# EAGLE design ism-boardlet (EAGLE 6.5.0)
CNAME: An RFM69CW breakout board; CREVISION: 1; DESIGNER: Johan Kanflo
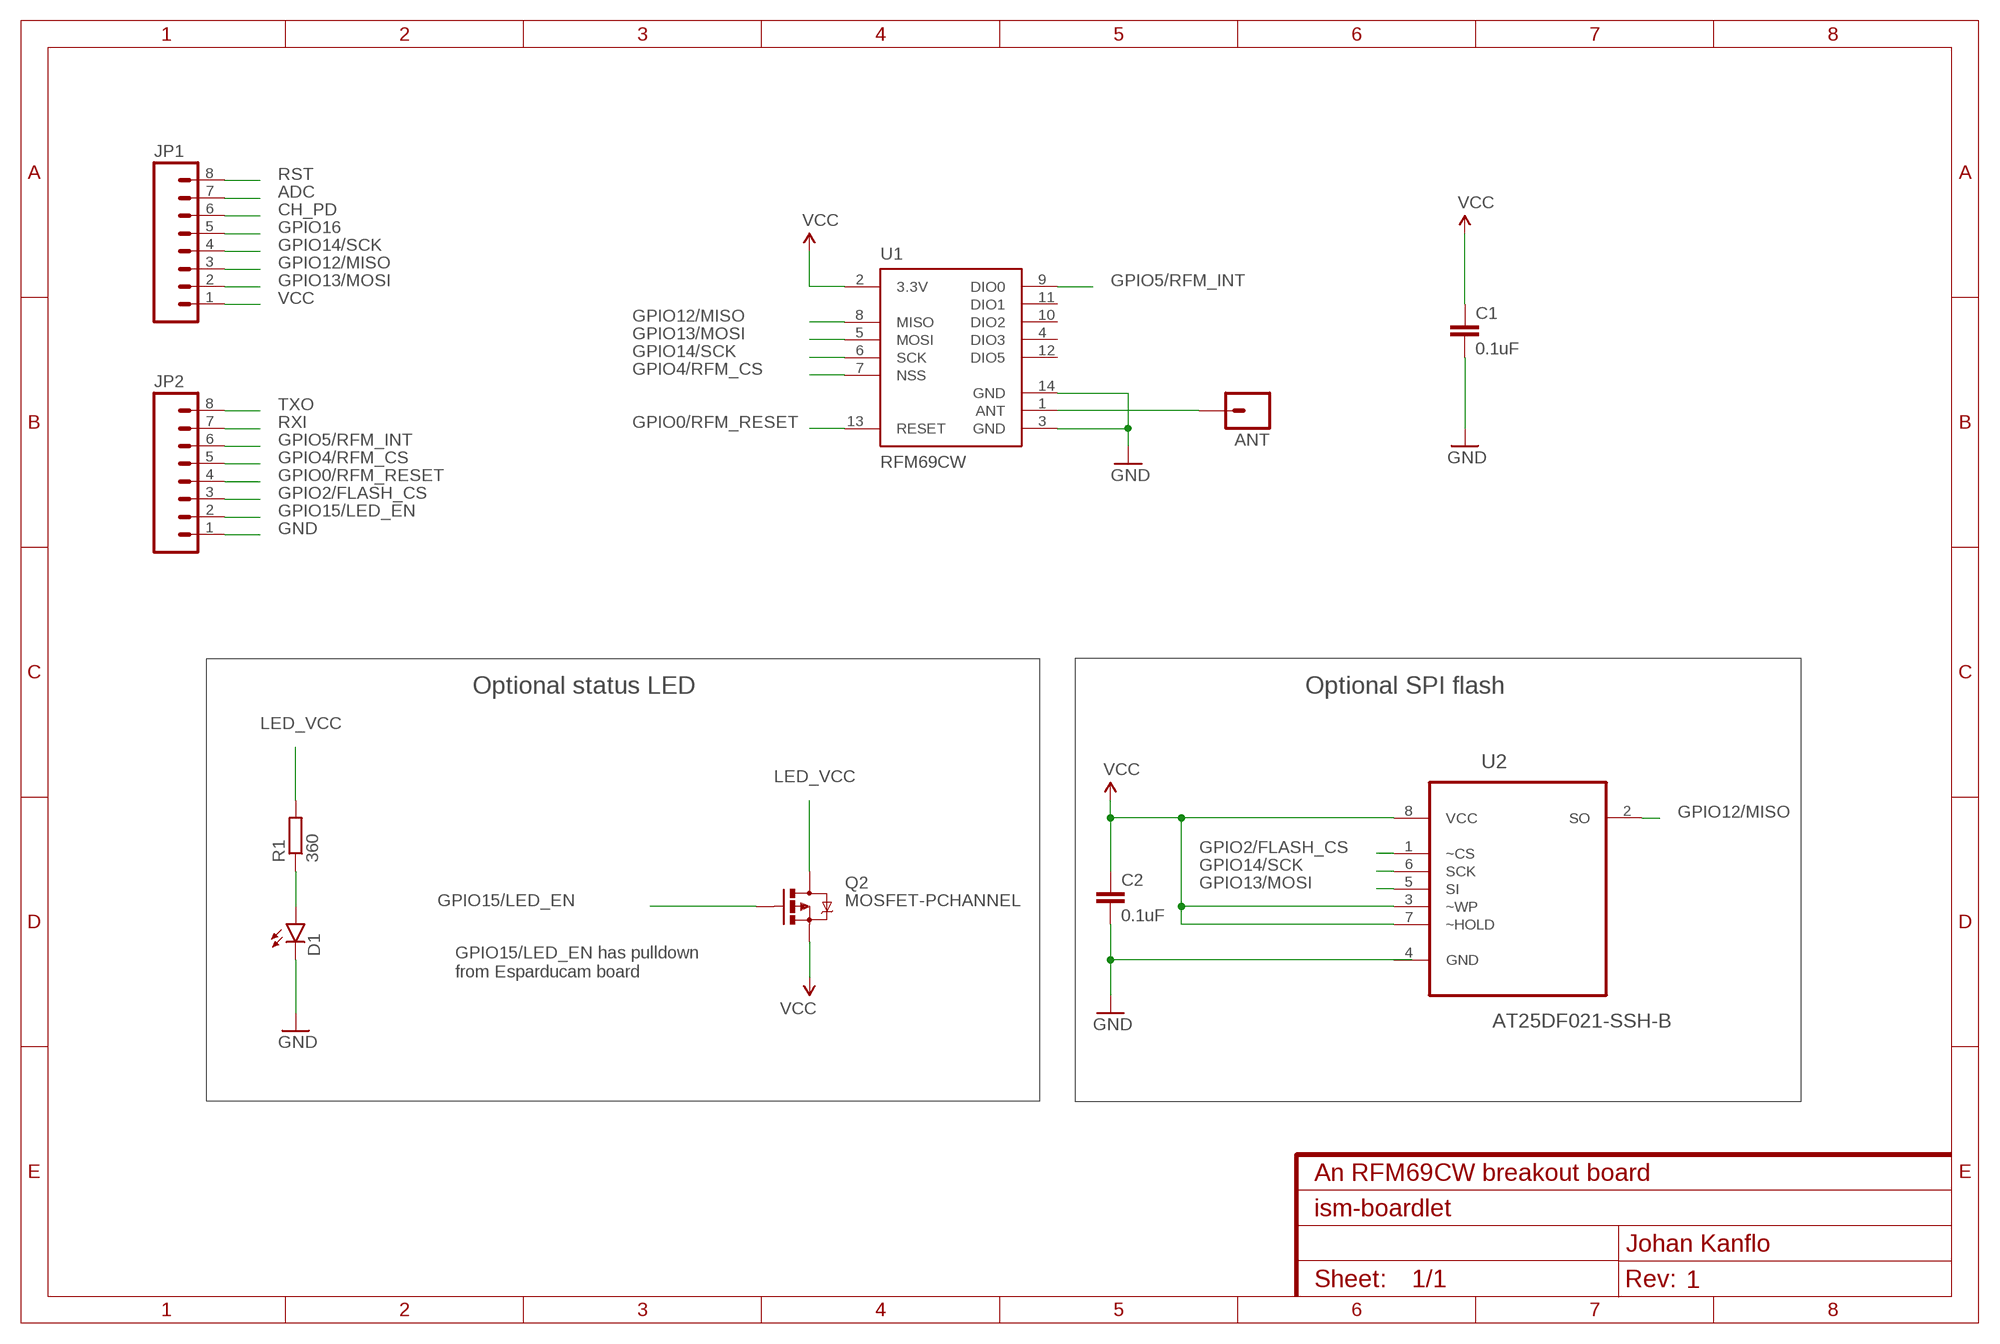
[diagram p0: schematic, sheet 1]

## Parts
ANT  M01PTH  [1X01]
C1  0.1uF  CAP0603-CAP  [0603-CAP]
C2  0.1uF  CAP0603-CAP  [0603-CAP]
D1  LED0603  [LED-0603]
JP1  M08  [1X08_ROUND]
JP2  M08  [1X08_ROUND]
Q2  MOSFET-PCHANNEL  [SOT23-3]
R1  360  R-EU_R0603  [R0603]
U1  RFM69CW  [RFM69CW-XXXS2]
U2  AT25DF021-SSH-B  [SOIC127P600X175-8N]

## Nets
ADC: JP1.7
CH_PD: JP1.6
GND: C1.2 C2.2 D1.C JP2.1 U1.3(GND) U1.14(GND)
GPIO0/RFM_RESET: JP2.4 U1.13(RESET)
GPIO2/FLASH_CS: JP2.3 U2.1(~CS)
GPIO4/RFM_CS: JP2.5 U1.7(NSS)
GPIO5/RFM_INT: JP2.6 U1.9(DIO0)
GPIO12/MISO: JP1.3 U1.8(MISO) U2.2(SO)
GPIO13/MOSI: JP1.2 U1.5(MOSI) U2.5(SI)
GPIO14/SCK: JP1.4 U1.6(SCK) U2.6(SCK)
GPIO15/LED_EN: JP2.2 Q2.1(G)
GPIO16: JP1.5
LED_VCC: Q2.3(D) R1.2
N$1: D1.A R1.1
N$8: ANT.1 U1.1(ANT)
RST: JP1.8
RXI: JP2.7
TXO: JP2.8
VCC: C1.1 C2.1 JP1.1 Q2.2(S) U1.2(3.3V) U2.3(~WP) U2.7(~HOLD) U2.8(VCC)
Unconnected: U1.4(DIO3) U1.10(DIO2) U1.11(DIO1) U1.12(DIO5) U2.4(GND)

## Notes on the sheet
- Optional status LED | Optional SPI flash
- GPIO15/LED_EN has pulldown
  from Esparducam board

## Library data of the parts
ANT = SparkFun-Connectors:M01: Header 1 Standard 1-pin 0.1" header. Use with straight break away headers (SKU : PRT-00116), right angle break away headers (PRT-00553), swiss pins (PRT-00743), machine pins (PRT-00117), and female headers (PRT-00115).
C1 C2 = SparkFun-Capacitors:CAP: Capacitor Standard 0603 ceramic capacitor, and 0.1" leaded capacitor.
D1 = SparkFun-LED:LED: LEDs Standard schematic elements and footprints for 5mm, 3mm, 1206, and 0603 sized LEDs. 5mm - Spark Fun Electronics SKU : COM-00529 (and others)
JP1 JP2 = SparkFun-Connectors:M08: Header 8 Standard 8-pin 0.1" header. Use with straight break away headers (SKU : PRT-00116), right angle break away headers (PRT-00553), swiss pins (PRT-00743), machine pins (PRT-00117), and female headers (PRT-00115).
Q2 = SparkFun-DiscreteSemi:MOSFET-PCHANNEL: Generic PMOSFET IRLML2244 - TRANS-11153 (SOT-23 -20V -4.3A) (1.Gate 2.Source 3.Drain) FQP27P06 - COM-10349 <http://www.sparkfun.com/products/10349> (TO-220 -60V -27A) (1.Gate 2.Source 3.Drain); PROD_ID: TRANS-08285
R1 = resistor:R-EU_: RESISTOR, European symbol
U1 = SparkFun-RF:RFM69
U2 = Atmel_By_element14_Batch_1-00:AT25DF021-SSH-B: 2-Megabit Minimum SPI Serial Flash Memory; MPN: AT25DF021-SSH-B; OC_FARNELL: 1715438; OC_NEWARK: 15R0303; PACKAGE: SOIC-8; SUPPLIER: Atmel

## Board
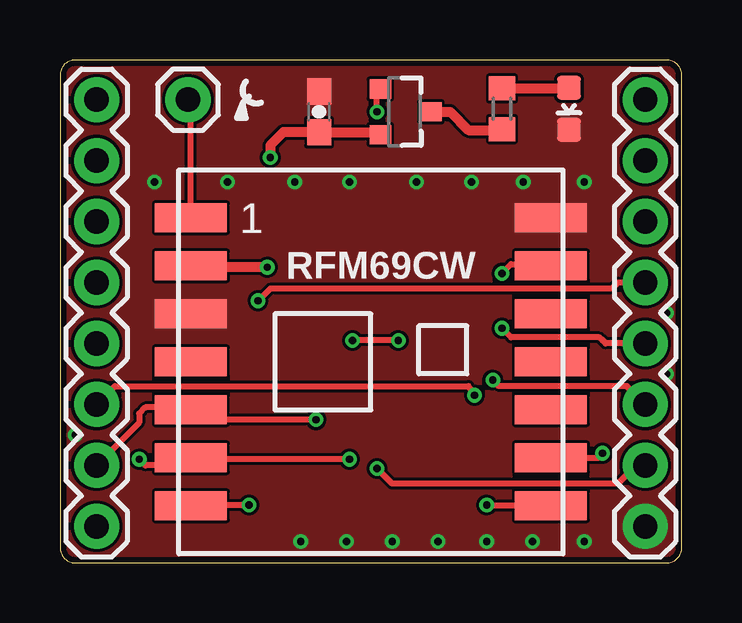
[diagram p1: board, top side]
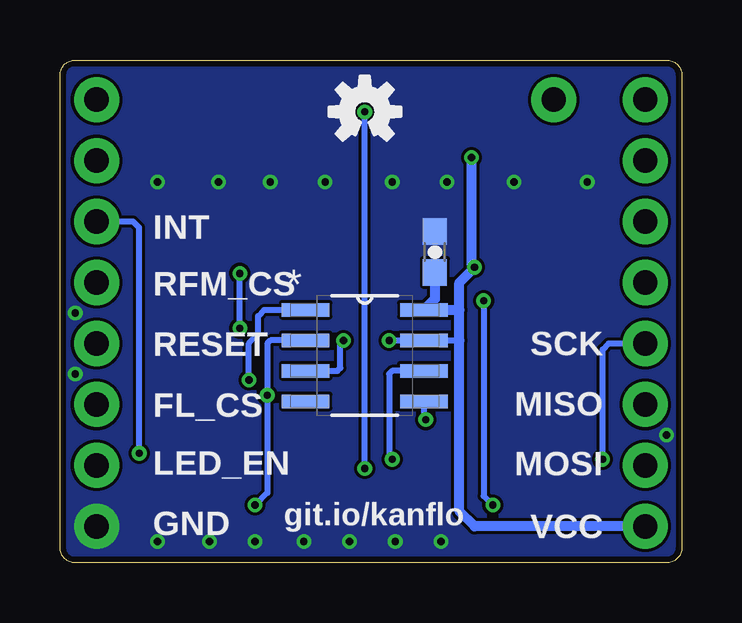
[diagram p2: board, bottom side, seen from below]

Size 25.91 x 20.95 mm. Coordinates in mm from the lower left corner, seen from the top.
Outline: 0,20.32 0,0.63 arc90 0.63,0 25.27,0 arc90 25.91,0.63 25.91,20.32 arc90 25.27,20.95 0.63,20.95 arc90 0,20.32
Copper layers (1*16): Top 0.035mm / dielectric 1.5mm / Bottom 0.035mm
Design rules "dirt_cheap_dirty_boards.v1": minimum track width 5mil, minimum drill 12mil, track to track 5mil, track to pad 5mil, pad to pad 5mil, via to via 5mil, smd to smd 0mil, copper to edge 10mil, drill to drill 10mil, minimum pad ring 10mil, minimum via ring 6mil, stop-mask expansion 2mil, vias tented up to drill 25mil, thermal gap 10mil

### Footprints (pad centres in the part's own frame; a part is rotated, then mirrored left to right if it is on the bottom)
1X01 = drill 1.016 pad 1.88: 1 0,0
0603-CAP = smd 1.1 x 1: 1 -0.85,0; 2 0.85,0
LED-0603 = smd 1 x 1: A 0,-0.877; C 0,0.877
1X08_ROUND = drill 1.016 pad 1.88: 1 0,0; 2 2.54,0; 3 5.08,0; 4 7.62,0; 5 10.16,0; 6 12.7,0; 7 15.24,0; 8 17.78,0
SOT23-3 = smd 0.8 x 0.9: 1 -0.95,-1; 2 0.95,-1; 3 0,1.1
R0603 = smd 1 x 1.1: 1 -0.85,0; 2 0.85,0
RFM69CW-XXXS2 = smd 3 x 1.2: 1 -7.5,6; 2 -7.5,4; 3 -7.5,2; 4 -7.5,0; 5 -7.5,-2; 6 -7.5,-4; 7 -7.5,-6; 8 7.5,-6; 9 7.5,-4; 10 7.5,-2; 11 7.5,0; 12 7.5,2; 13 7.5,4; 14 7.5,6
SOIC127P600X175-8N = smd 1.981 x 0.559: 1 -2.464,1.905; 2 -2.464,0.635; 3 -2.464,-0.635; 4 -2.464,-1.905; 5 2.464,-1.905; 6 2.464,-0.635; 7 2.464,0.635; 8 2.464,1.905

### Placement (x,y rotation side)
ANT  5.33,19.3 0 top
C1  10.79,18.8 90 top
C2  10.29,12.95 90 bottom
D1  21.21,18.92 180 top
JP1  1.52,1.52 90 top
JP2  24.38,1.52 90 top
Q2  14.35,18.8 270 top
R1  18.41,18.92 270 top
U1  12.95,8.38 0 top
U2  13.21,8.64 0 bottom
U$2  [OSHW-LOGO-S]  13.21,18.8 0 bottom

### Tracks (layer width: path | path; a pad name or v marks a point on that pad's centre or on a via)
GND  (via drill 0.3 pad 0.25)
  other vias: 10.03,0.89 11.94,0.89 13.84,0.89 15.75,0.89 17.78,0.89 19.69,0.89 21.84,0.89 3.94,15.87 6.99,15.87 9.78,15.87 12.06,15.87 14.86,15.87 17.15,15.87 19.3,15.87 21.84,15.87 0.63,5.33 25.27,7.87 25.27,10.41
  pour Bottom (rank 6, no thermals): 0,20.95 25.91,20.95 25.91,0 0,0
  pour Top (rank 6, no thermals): 0,20.95 25.91,20.95 25.91,0 0,0
GPIO0/RFM_RESET  (via drill 0.3 pad 0.25)
  Top 0.254: JP2.4 22.73,9.14 22.61,9.27 22.48,9.4 18.8,9.4 v18.41,9.78 | v18.41,12.06 18.8,12.45 20.39,12.45 U1.13
  Bottom 0.254: v18.41,9.78 v18.41,12.06
GPIO2/FLASH_CS  (via drill 0.3 pad 0.25)
  Top 0.254: JP2.3 23.88,7.11 23.75,7.24 23.62,7.37 18.29,7.37 v18.03,7.62
  Bottom 0.254: v18.03,7.62 18.03,9.14 17.65,9.53 17.65,10.29 17.4,10.54 U2.1
GPIO4/RFM_CS  (via drill 0.3 pad 0.25)
  Top 0.254: JP2.5 23.24,11.68 22.99,11.43 8.76,11.43 v8.26,10.92 | v7.87,2.41 5.97,2.41 5.49,2.41 U1.7
  Bottom 0.254: v8.26,10.92 8.26,2.79 v7.87,2.41
GPIO5/RFM_INT  (via drill 0.3 pad 0.25)
  Top 0.254: U1.9 22.42,4.38 v22.61,4.57
  Bottom 0.254: v22.61,4.57 22.61,13.97 22.86,14.22 JP2.6
GPIO12/MISO  (via drill 0.3 pad 0.25)
  Top 0.254: JP1.3 2.29,7.37 17.02,7.37 v17.27,6.99 | v17.78,2.41 20.42,2.41 U1.8
  Bottom 0.254: v17.78,2.41 17.27,2.92 v17.27,6.99 17.27,9.14 17.15,9.27 U2.2
GPIO13/MOSI  (via drill 0.3 pad 0.25)
  Top 0.254: 1.65,4.06 JP1.2 3.3,5.84 3.3,6.22 3.56,6.48 4.06,6.48 5.36,6.48 | 5.36,6.48 U1.5 | 5.36,6.48 U1.5 | v10.67,5.97 5.87,5.97 U1.5
  Bottom 0.254: U2.5 10.74,6.04 v10.67,5.97
GPIO14/SCK  (via drill 0.3 pad 0.25)
  Top 0.254: v3.3,4.32 3.56,4.06 4.06,4.06 4.38,4.38 U1.6 5.52,4.32 v12.06,4.32
  Bottom 0.254: v3.3,4.32 3.3,8.89 3.05,9.14 JP1.4 | U2.6 12.06,8 12.19,7.87 12.19,4.45 v12.06,4.32
GPIO15/LED_EN  (via drill 0.3 pad 0.25)
  Top 0.254: JP2.2 24,4.06 23.24,3.3 13.84,3.3 v13.21,3.94 | v13.21,18.8 13.21,19.6 Q2.1
  Bottom 0.254: v13.21,3.94 v13.21,18.8
LED_VCC
  Top 0.254: 18.38,18.03 R1.2
  Top 0.406: Q2.3 16.26,18.8 17.02,18.03 18.38,18.03
N$1
  Top 0.406: R1.1 21.18,19.77 D1.A
N$8
  Top 0.254: U1.1 5.45,19.18 ANT.1
VCC  (via drill 0.3 pad 0.25)
  Top 0.254: v14.1,9.27 v12.19,9.27
  Top 0.406: v8.64,12.32 5.52,12.32 U1.2 | v8.76,16.89 8.76,17.4 9.31,17.95 C1.1 13.25,17.95 Q2.2
  Bottom 0.254: 9.27,9.27 U2.7 v12.19,9.27 | U2.3 14.35,8 14.22,8.13 14.22,9.14 v14.1,9.27
  Bottom 0.406: JP1.1 8.64,1.52 9.27,2.16 9.27,9.27 9.27,10.54 | 9.27,10.54 9.27,11.68 v8.64,12.32 8.76,12.45 v8.76,16.89 | C2.1 10.29,11 U2.8 9.27,10.54

### Text on the board
bNames: INT | RFM_CS | SCK | RESET | MISO | FL_CS | MOSI | LED_EN | VCC | git.io/kanflo | GND
Document: RESET | TXO | ADC | RXI | CH_EN | GPIO5/RFM_INT | 16 | GPIO4/RFM_CS | SCK 14 | GPIO0/RFM_RESET | MISO 12 | GPIO2/FLASH_CS | MOSI 13 | GPIO15/LED_EN | VCC | GND